# Altium schematic sheet Sheet1.SchDoc
size A
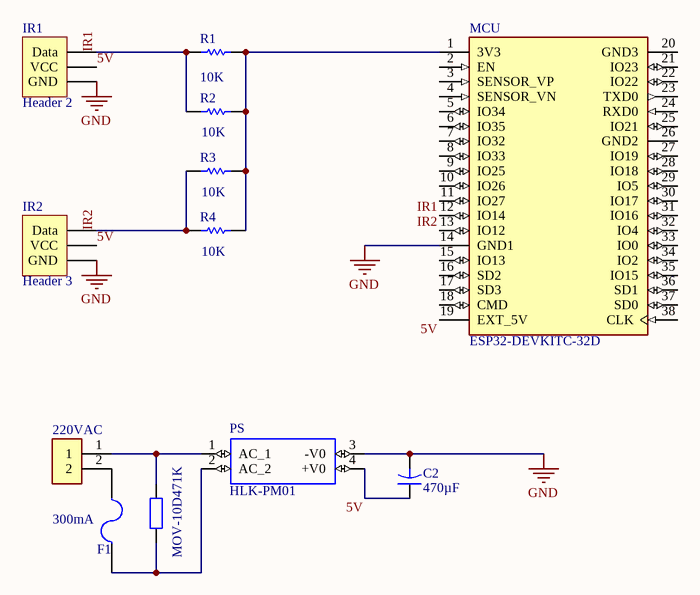
[diagram p0: Sheet1.SchDoc]

## Parts
220VAC  282837-2  [TE_282837-2]  (value not drawn)
C2  value 470µF  [CAPR5-4X5]  (hidden comment: Cap2)
F1  300mA  [PIN-W2/E2.8]
IR1  Header 2  [HDR1X3]
IR2  Header 3  [HDR1X3]
MCU  ESP32-DEVKITC-32D  [MODULE_ESP32-DEVKITC-32D]
PS  HLK-PM01  [HLKPM01]
R1  value 10K  [AXIAL-0.3]
R2  value 10K  [AXIAL-0.3]
R3  value 10K  [AXIAL-0.3]
R4  value 10K  [AXIAL-0.3]
VAR1  MOV-10D471K  [AXIAL-0.4]

## Nets
GND: C2.2 IR1.1(GND) IR2.1(GND) MCU.14(GND1) PS.3(-V0)
5V: C2.1 IR1.2(VCC) IR2.2(VCC) MCU.19(EXT_5V) PS.4(+V0)
IR1: IR1.3(Data) MCU.12(IO14) R1.2 R2.2
IR2: IR2.3(Data) MCU.13(IO12) R3.2 R4.2
Net220VAC_1: 220VAC.1 PS.1(AC_1) VAR1.2
Net220VAC_2: 220VAC.2 F1.2
NetF1_1: F1.1 PS.2(AC_2) VAR1.1
NetMCU_1: MCU.1(3V3) R1.1 R2.1 R3.1 R4.1

Not connected (* = marked no-connect by the designer): MCU 2(EN) 3(SENSOR_VP) 4(SENSOR_VN) 5(IO34) 6(IO35) 7(IO32) 8(IO33) 9(IO25) 10(IO26) 11(IO27) 15(IO13) 16(SD2) 17(SD3) 18(CMD) 20(GND3) 21(IO23) 22(IO22) 23(TXD0) 24(RXD0) 25(IO21) 26(GND2) 27(IO19) 28(IO18) 29(IO5) 30(IO17) 31(IO16) 32(IO4) 33(IO0) 34(IO2) 35(IO15) 36(SD1) 37(SD0) 38(CLK)

## Library data of the parts
220VAC = 282837-2: Connector Terminal Blocks Receptacle 2 Position 5.08mm Solder Straight Thru-Hole 13.5A/Contact; MF: TE Connectivity; Digi-Key_Purchase_URL: https://www.digikey.in/product-detail/en/te-connectivity-amp-connectors/282837-2/A113320-ND/2187973?utm_source=snapeda&utm_medium=aggregator&utm_campaign=symbol; Value: *; TE_purchase_URL: https://www.te.com/usa-en/product-282837-2.html?te_bu=Cor&te_type=disp&te_campaign=seda_glo_cor-seda-global-disp-prtnr-fy19-seda-model-bom-cta_sma-317_1&elqCampaignId=32493; Package: None; MP: 282837-2; SnapEDA_Link: https://www.snapeda.com/parts/282837-2/TE%20Connectivity%20AMP%20Connectors/view-part/2549980/?ref=snap; Digi-Key_Part_Number: A113320-ND; Comment_1: *
C2 = Cap2: Capacitor; Published: 23-Sep-2002; PackageReference: CAPR5-4X5; Publisher: Altium Limited; PackageDescription: Capacitor; 2 Leads
F1 = Fuse 2: Fuse; Published: 8-Jun-2000; LatestRevisionDate: 17-Jul-2002; LatestRevisionNote: Re-released for DXP Platform.; PackageReference: PIN-W2/E2.8; Publisher: Altium Limited; PackageDescription: Thru-Hole; 2 Leads
IR1 IR2 = Header 3: Header, 3-Pin; LatestRevisionDate: 17-Jul-2002; LatestRevisionNote: Re-released for DXP Platform.; Publisher: Altium Limited
MCU = ESP32-DEVKITC-32D: - Transceiver; 802.11 b/g/n _Wi-Fi, WiFi, WLAN_, BluetoothÂ® Smart Ready 4.x Dual Mode For Use With ESP-WROOM-32; MF: Espressif Systems; Package: None; Price: None; Availability: Unavailable; MP: ESP32-DEVKITC-32D; SnapEDA_Link: https://www.snapeda.com/parts/ESP32-DEVKITC-32D/Espressif%20Systems/view-part/2777395/?ref=snap; Value: *
PS = HLK-PM01: <b>Ultra-compact power module</b><p> Source: <a href="https://datasheet.lcsc.com/szlcsc/1906201102_HI-LINK-HLK-PM03_C209904.pdf"> Datasheet </a>; Package: Package Analog Devices; MF: Hi-link; Availability: Unavailable; Value: *; MP: hlk-pm01; Price: None; SnapEDA_Link: https://www.snapeda.com/parts/hlk-pm01/Hi-link/view-part/2875605/?ref=snap
R1-R4 = Res1: Resistor; Published: 8-Jun-2000; LatestRevisionDate: 17-Jul-2002; LatestRevisionNote: Re-released for DXP Platform.; PackageReference: AXIAL-0.3; Publisher: Altium Limited; PackageDescription: Axial Device, Thru-Hole; 2 Leads; 0.3 in Pin Spacing
VAR1 = Res2: Value: 1K; Published: 8-Jun-2000; LatestRevisionDate: 17-Jul-2002; LatestRevisionNote: Re-released for DXP Platform.; PackageReference: AXIAL-0.4; Publisher: Altium Limited; PackageDescription: Axial Device, Thru-Hole; 2 Leads; 0.4 in Pin Spacing